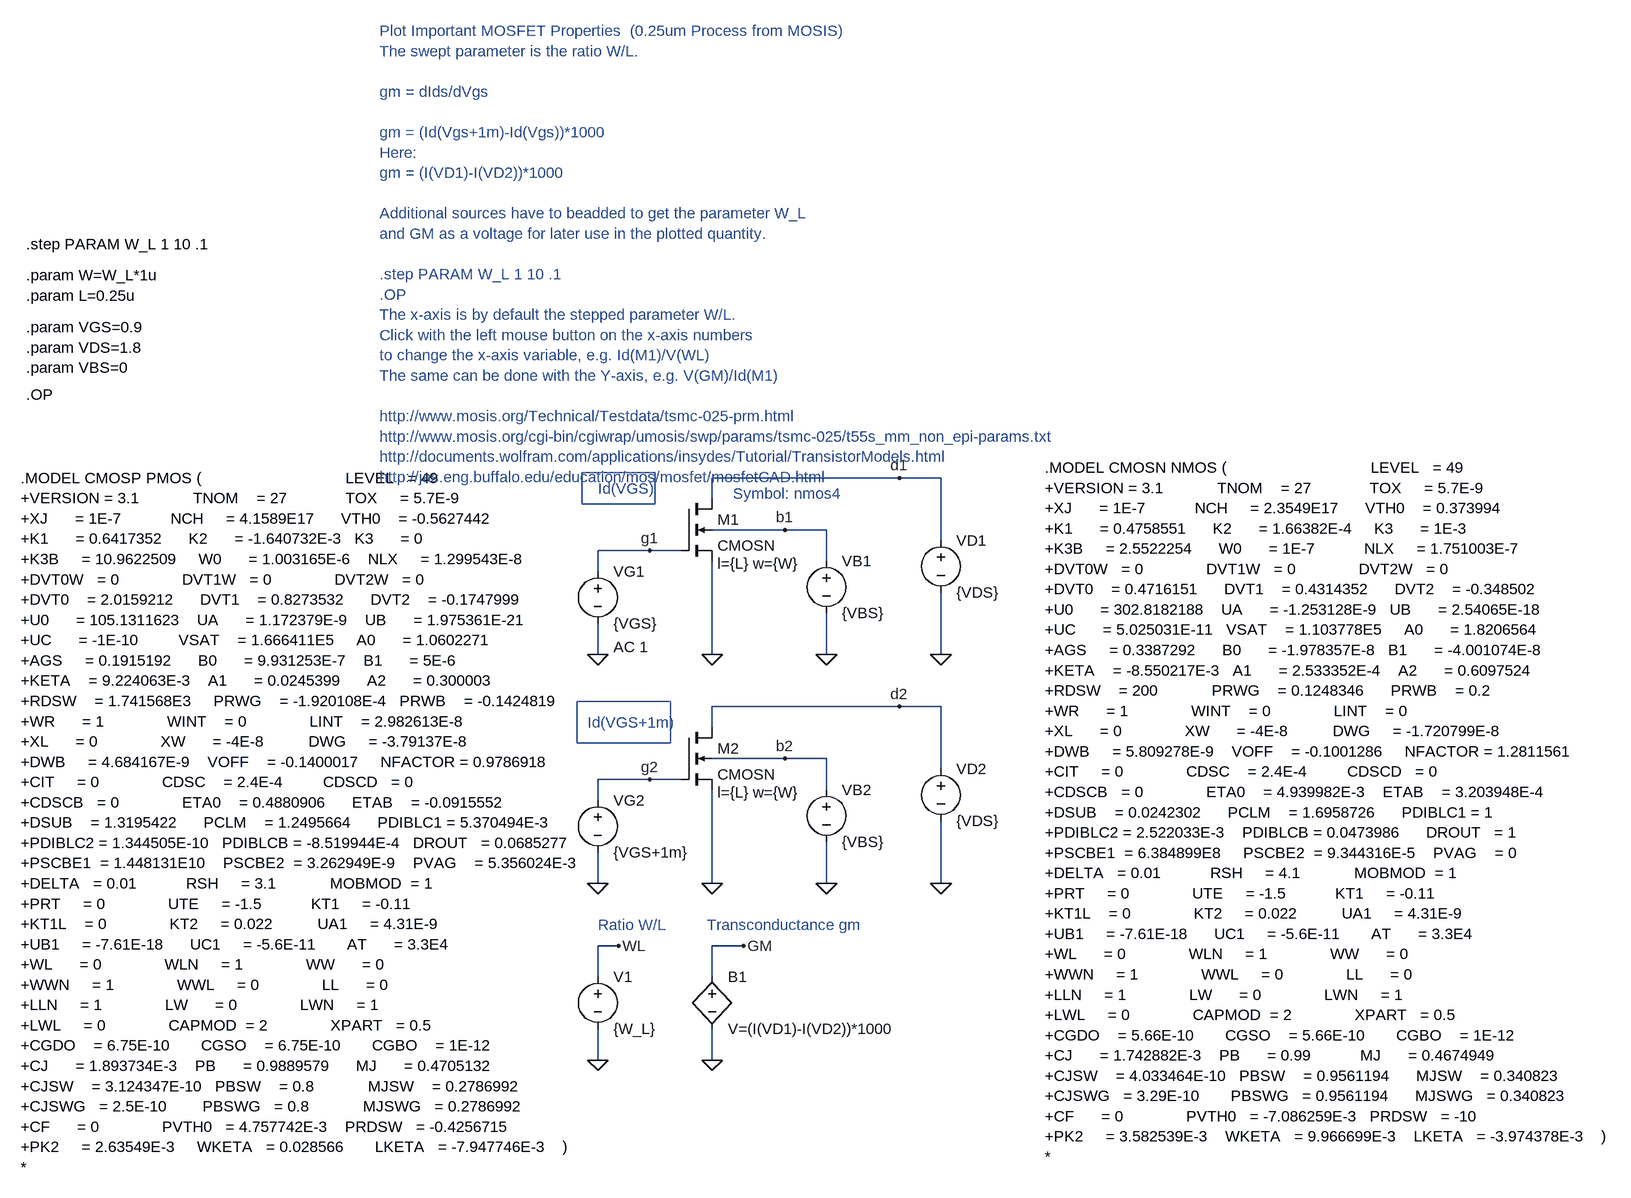
[diagram p0: schematic MOSFET_gm_and_Id_versus_W_to_L.asc]
MOSFET_gm_and_Id_versus_W_to_L.asc, the LTspice schematic file:
Version 4
SHEET 1 3220 2244
WIRE 48 192 -240 192
WIRE 112 192 48 192
WIRE -240 224 -240 192
WIRE -128 272 -240 272
WIRE -64 272 -128 272
WIRE 112 288 112 192
WIRE -336 304 -416 304
WIRE -288 304 -336 304
WIRE -64 320 -64 272
WIRE -416 336 -416 304
WIRE -416 464 -416 416
WIRE -240 464 -240 320
WIRE -64 464 -64 400
WIRE 112 464 112 368
WIRE 48 544 -240 544
WIRE 112 544 48 544
WIRE -240 576 -240 544
WIRE -128 624 -240 624
WIRE -64 624 -128 624
WIRE 112 640 112 544
WIRE -336 656 -416 656
WIRE -288 656 -336 656
WIRE -64 672 -64 624
WIRE -416 688 -416 656
WIRE -416 816 -416 768
WIRE -240 816 -240 672
WIRE -64 816 -64 752
WIRE 112 816 112 720
WIRE -384 912 -416 912
WIRE -192 912 -240 912
WIRE -416 960 -416 912
WIRE -240 960 -240 912
WIRE -416 1088 -416 1040
WIRE -240 1088 -240 1040
FLAG -416 464 0
FLAG 112 464 0
FLAG -336 304 g1
FLAG -64 464 0
FLAG -240 464 0
FLAG -416 816 0
FLAG 112 816 0
FLAG -336 656 g2
FLAG 48 544 d2
FLAG -64 816 0
FLAG -128 624 b2
FLAG -240 816 0
FLAG -128 272 b1
FLAG 48 192 d1
FLAG -416 1088 0
FLAG -384 912 WL
FLAG -240 1088 0
FLAG -192 912 GM
SYMBOL voltage 112 272 R0
SYMATTR InstName VD1
SYMATTR Value {VDS}
SYMBOL voltage -416 320 R0
WINDOW 123 24 132 Left 0
WINDOW 39 0 0 Left 0
SYMATTR Value2 AC 1
SYMATTR InstName VG1
SYMATTR Value {VGS}
SYMBOL nmos4 -288 224 R0
WINDOW 123 56 100 Left 0
SYMATTR Value2 l={L} w={W}
SYMATTR InstName M1
SYMATTR Value CMOSN
SYMBOL voltage -64 304 R0
SYMATTR InstName VB1
SYMATTR Value {VBS}
SYMBOL voltage 112 624 R0
WINDOW 123 24 132 Left 0
WINDOW 39 0 0 Left 0
SYMATTR InstName VD2
SYMATTR Value {VDS}
SYMBOL voltage -416 672 R0
WINDOW 123 24 132 Left 0
WINDOW 39 0 0 Left 0
SYMATTR InstName VG2
SYMATTR Value {VGS+1m}
SYMBOL voltage -64 656 R0
SYMATTR InstName VB2
SYMATTR Value {VBS}
SYMBOL nmos4 -288 576 R0
WINDOW 123 56 100 Left 0
SYMATTR Value2 l={L} w={W}
SYMATTR InstName M2
SYMATTR Value CMOSN
SYMBOL voltage -416 944 R0
SYMATTR InstName V1
SYMATTR Value {W_L}
SYMBOL bv -240 944 R0
SYMATTR InstName B1
SYMATTR Value V=(I(VD1)-I(VD2))*1000
TEXT -1296 64 Left 0 !.OP
TEXT 272 176 Left 0 !.MODEL CMOSN NMOS (                                LEVEL   = 49\n+VERSION = 3.1            TNOM    = 27             TOX     = 5.7E-9\n+XJ      = 1E-7           NCH     = 2.3549E17      VTH0    = 0.373994\n+K1      = 0.4758551      K2      = 1.66382E-4     K3      = 1E-3\n+K3B     = 2.5522254      W0      = 1E-7           NLX     = 1.751003E-7\n+DVT0W   = 0              DVT1W   = 0              DVT2W   = 0\n+DVT0    = 0.4716151      DVT1    = 0.4314352      DVT2    = -0.348502\n+U0      = 302.8182188    UA      = -1.253128E-9   UB      = 2.54065E-18\n+UC      = 5.025031E-11   VSAT    = 1.103778E5     A0      = 1.8206564\n+AGS     = 0.3387292      B0      = -1.978357E-8   B1      = -4.001074E-8\n+KETA    = -8.550217E-3   A1      = 2.533352E-4    A2      = 0.6097524\n+RDSW    = 200            PRWG    = 0.1248346      PRWB    = 0.2\n+WR      = 1              WINT    = 0              LINT    = 0\n+XL      = 0              XW      = -4E-8          DWG     = -1.720799E-8\n+DWB     = 5.809278E-9    VOFF    = -0.1001286     NFACTOR = 1.2811561\n+CIT     = 0              CDSC    = 2.4E-4         CDSCD   = 0\n+CDSCB   = 0              ETA0    = 4.939982E-3    ETAB    = 3.203948E-4\n+DSUB    = 0.0242302      PCLM    = 1.6958726      PDIBLC1 = 1\n+PDIBLC2 = 2.522033E-3    PDIBLCB = 0.0473986      DROUT   = 1\n+PSCBE1  = 6.384899E8     PSCBE2  = 9.344316E-5    PVAG    = 0\n+DELTA   = 0.01           RSH     = 4.1            MOBMOD  = 1\n+PRT     = 0              UTE     = -1.5           KT1     = -0.11\n+KT1L    = 0              KT2     = 0.022          UA1     = 4.31E-9\n+UB1     = -7.61E-18      UC1     = -5.6E-11       AT      = 3.3E4\n+WL      = 0              WLN     = 1              WW      = 0\n+WWN     = 1              WWL     = 0              LL      = 0\n+LLN     = 1              LW      = 0              LWN     = 1\n+LWL     = 0              CAPMOD  = 2              XPART   = 0.5\n+CGDO    = 5.66E-10       CGSO    = 5.66E-10       CGBO    = 1E-12\n+CJ      = 1.742882E-3    PB      = 0.99           MJ      = 0.4674949\n+CJSW    = 4.033464E-10   PBSW    = 0.9561194      MJSW    = 0.340823\n+CJSWG   = 3.29E-10       PBSWG   = 0.9561194      MJSWG   = 0.340823\n+CF      = 0              PVTH0   = -7.086259E-3   PRDSW   = -10\n+PK2     = 3.582539E-3    WKETA   = 9.966699E-3    LKETA   = -3.974378E-3    )\n*
TEXT -1296 -40 Left 0 !.param VGS=0.9\n.param VDS=1.8\n.param VBS=0
TEXT -1304 192 Left 0 !.MODEL CMOSP PMOS (                                LEVEL   = 49\n+VERSION = 3.1            TNOM    = 27             TOX     = 5.7E-9\n+XJ      = 1E-7           NCH     = 4.1589E17      VTH0    = -0.5627442\n+K1      = 0.6417352      K2      = -1.640732E-3   K3      = 0\n+K3B     = 10.9622509     W0      = 1.003165E-6    NLX     = 1.299543E-8\n+DVT0W   = 0              DVT1W   = 0              DVT2W   = 0\n+DVT0    = 2.0159212      DVT1    = 0.8273532      DVT2    = -0.1747999\n+U0      = 105.1311623    UA      = 1.172379E-9    UB      = 1.975361E-21\n+UC      = -1E-10         VSAT    = 1.666411E5     A0      = 1.0602271\n+AGS     = 0.1915192      B0      = 9.931253E-7    B1      = 5E-6\n+KETA    = 9.224063E-3    A1      = 0.0245399      A2      = 0.300003\n+RDSW    = 1.741568E3     PRWG    = -1.920108E-4   PRWB    = -0.1424819\n+WR      = 1              WINT    = 0              LINT    = 2.982613E-8\n+XL      = 0              XW      = -4E-8          DWG     = -3.79137E-8\n+DWB     = 4.684167E-9    VOFF    = -0.1400017     NFACTOR = 0.9786918\n+CIT     = 0              CDSC    = 2.4E-4         CDSCD   = 0\n+CDSCB   = 0              ETA0    = 0.4880906      ETAB    = -0.0915552\n+DSUB    = 1.3195422      PCLM    = 1.2495664      PDIBLC1 = 5.370494E-3\n+PDIBLC2 = 1.344505E-10   PDIBLCB = -8.519944E-4   DROUT   = 0.0685277\n+PSCBE1  = 1.448131E10    PSCBE2  = 3.262949E-9    PVAG    = 5.356024E-3\n+DELTA   = 0.01           RSH     = 3.1            MOBMOD  = 1\n+PRT     = 0              UTE     = -1.5           KT1     = -0.11\n+KT1L    = 0              KT2     = 0.022          UA1     = 4.31E-9\n+UB1     = -7.61E-18      UC1     = -5.6E-11       AT      = 3.3E4\n+WL      = 0              WLN     = 1              WW      = 0\n+WWN     = 1              WWL     = 0              LL      = 0\n+LLN     = 1              LW      = 0              LWN     = 1\n+LWL     = 0              CAPMOD  = 2              XPART   = 0.5\n+CGDO    = 6.75E-10       CGSO    = 6.75E-10       CGBO    = 1E-12\n+CJ      = 1.893734E-3    PB      = 0.9889579      MJ      = 0.4705132\n+CJSW    = 3.124347E-10   PBSW    = 0.8            MJSW    = 0.2786992\n+CJSWG   = 2.5E-10        PBSWG   = 0.8            MJSWG   = 0.2786992\n+CF      = 0              PVTH0   = 4.757742E-3    PRDSW   = -0.4256715\n+PK2     = 2.63549E-3     WKETA   = 0.028566       LKETA   = -7.947746E-3    )\n*
TEXT -416 208 Left 0 ;Id(VGS)
TEXT -432 568 Left 0 ;Id(VGS+1m)
TEXT -208 216 Left 0 ;Symbol: nmos4
TEXT -752 -496 Left 0 ;Plot Important MOSFET Properties  (0.25um Process from MOSIS)\nThe swept parameter is the ratio W/L.\n \ngm = dIds/dVgs\n \ngm = (Id(Vgs+1m)-Id(Vgs))*1000\nHere:\ngm = (I(VD1)-I(VD2))*1000\n \nAdditional sources have to beadded to get the parameter W_L \nand GM as a voltage for later use in the plotted quantity.\n \n.step PARAM W_L 1 10 .1\n.OP\nThe x-axis is by default the stepped parameter W/L.\nClick with the left mouse button on the x-axis numbers \nto change the x-axis variable, e.g. Id(M1)/V(WL)\nThe same can be done with the Y-axis, e.g. V(GM)/Id(M1)\n \nhttp://www.mosis.org/Technical/Testdata/tsmc-025-prm.html \nhttp://www.mosis.org/cgi-bin/cgiwrap/umosis/swp/params/tsmc-025/t55s_mm_non_epi-params.txt\nhttp://documents.wolfram.com/applications/insydes/Tutorial/TransistorModels.html\nhttp://jas.eng.buffalo.edu/education/mos/mosfet/mosfetCAD.html
TEXT -1296 -120 Left 0 !.param W=W_L*1u\n.param L=0.25u
TEXT -1296 -168 Left 0 !.step PARAM W_L 1 10 .1
TEXT -416 880 Left 0 ;Ratio W/L
TEXT -248 880 Left 0 ;Transconductance gm
RECTANGLE Normal -328 232 -440 184
RECTANGLE Normal -304 600 -448 536

The netlist it stands for:
* MOSFET_gm_and_Id_versus_W_to_L.asc
VD1 d1 0 {VDS}
VG1 g1 0 {VGS} AC 1
M1 d1 g1 0 b1 CMOSN l={L} w={W}
VB1 b1 0 {VBS}
VD2 d2 0 {VDS}
VG2 g2 0 {VGS+1m}
VB2 b2 0 {VBS}
M2 d2 g2 0 b2 CMOSN l={L} w={W}
V1 WL 0 {W_L}
B1 GM 0 V=(I(VD1)-I(VD2))*1000
.model NMOS NMOS
.model PMOS PMOS
.lib standard.mos
.OP
.MODEL CMOSN NMOS (                                LEVEL   = 49
+VERSION = 3.1            TNOM    = 27             TOX     = 5.7E-9
+XJ      = 1E-7           NCH     = 2.3549E17      VTH0    = 0.373994
+K1      = 0.4758551      K2      = 1.66382E-4     K3      = 1E-3
+K3B     = 2.5522254      W0      = 1E-7           NLX     = 1.751003E-7
+DVT0W   = 0              DVT1W   = 0              DVT2W   = 0
+DVT0    = 0.4716151      DVT1    = 0.4314352      DVT2    = -0.348502
+U0      = 302.8182188    UA      = -1.253128E-9   UB      = 2.54065E-18
+UC      = 5.025031E-11   VSAT    = 1.103778E5     A0      = 1.8206564
+AGS     = 0.3387292      B0      = -1.978357E-8   B1      = -4.001074E-8
+KETA    = -8.550217E-3   A1      = 2.533352E-4    A2      = 0.6097524
+RDSW    = 200            PRWG    = 0.1248346      PRWB    = 0.2
+WR      = 1              WINT    = 0              LINT    = 0
+XL      = 0              XW      = -4E-8          DWG     = -1.720799E-8
+DWB     = 5.809278E-9    VOFF    = -0.1001286     NFACTOR = 1.2811561
+CIT     = 0              CDSC    = 2.4E-4         CDSCD   = 0
+CDSCB   = 0              ETA0    = 4.939982E-3    ETAB    = 3.203948E-4
+DSUB    = 0.0242302      PCLM    = 1.6958726      PDIBLC1 = 1
+PDIBLC2 = 2.522033E-3    PDIBLCB = 0.0473986      DROUT   = 1
+PSCBE1  = 6.384899E8     PSCBE2  = 9.344316E-5    PVAG    = 0
+DELTA   = 0.01           RSH     = 4.1            MOBMOD  = 1
+PRT     = 0              UTE     = -1.5           KT1     = -0.11
+KT1L    = 0              KT2     = 0.022          UA1     = 4.31E-9
+UB1     = -7.61E-18      UC1     = -5.6E-11       AT      = 3.3E4
+WL      = 0              WLN     = 1              WW      = 0
+WWN     = 1              WWL     = 0              LL      = 0
+LLN     = 1              LW      = 0              LWN     = 1
+LWL     = 0              CAPMOD  = 2              XPART   = 0.5
+CGDO    = 5.66E-10       CGSO    = 5.66E-10       CGBO    = 1E-12
+CJ      = 1.742882E-3    PB      = 0.99           MJ      = 0.4674949
+CJSW    = 4.033464E-10   PBSW    = 0.9561194      MJSW    = 0.340823
+CJSWG   = 3.29E-10       PBSWG   = 0.9561194      MJSWG   = 0.340823
+CF      = 0              PVTH0   = -7.086259E-3   PRDSW   = -10
+PK2     = 3.582539E-3    WKETA   = 9.966699E-3    LKETA   = -3.974378E-3    )
*
.param VGS=0.9
.param VDS=1.8
.param VBS=0
.MODEL CMOSP PMOS (                                LEVEL   = 49
+VERSION = 3.1            TNOM    = 27             TOX     = 5.7E-9
+XJ      = 1E-7           NCH     = 4.1589E17      VTH0    = -0.5627442
+K1      = 0.6417352      K2      = -1.640732E-3   K3      = 0
+K3B     = 10.9622509     W0      = 1.003165E-6    NLX     = 1.299543E-8
+DVT0W   = 0              DVT1W   = 0              DVT2W   = 0
+DVT0    = 2.0159212      DVT1    = 0.8273532      DVT2    = -0.1747999
+U0      = 105.1311623    UA      = 1.172379E-9    UB      = 1.975361E-21
+UC      = -1E-10         VSAT    = 1.666411E5     A0      = 1.0602271
+AGS     = 0.1915192      B0      = 9.931253E-7    B1      = 5E-6
+KETA    = 9.224063E-3    A1      = 0.0245399      A2      = 0.300003
+RDSW    = 1.741568E3     PRWG    = -1.920108E-4   PRWB    = -0.1424819
+WR      = 1              WINT    = 0              LINT    = 2.982613E-8
+XL      = 0              XW      = -4E-8          DWG     = -3.79137E-8
+DWB     = 4.684167E-9    VOFF    = -0.1400017     NFACTOR = 0.9786918
+CIT     = 0              CDSC    = 2.4E-4         CDSCD   = 0
+CDSCB   = 0              ETA0    = 0.4880906      ETAB    = -0.0915552
+DSUB    = 1.3195422      PCLM    = 1.2495664      PDIBLC1 = 5.370494E-3
+PDIBLC2 = 1.344505E-10   PDIBLCB = -8.519944E-4   DROUT   = 0.0685277
+PSCBE1  = 1.448131E10    PSCBE2  = 3.262949E-9    PVAG    = 5.356024E-3
+DELTA   = 0.01           RSH     = 3.1            MOBMOD  = 1
+PRT     = 0              UTE     = -1.5           KT1     = -0.11
+KT1L    = 0              KT2     = 0.022          UA1     = 4.31E-9
+UB1     = -7.61E-18      UC1     = -5.6E-11       AT      = 3.3E4
+WL      = 0              WLN     = 1              WW      = 0
+WWN     = 1              WWL     = 0              LL      = 0
+LLN     = 1              LW      = 0              LWN     = 1
+LWL     = 0              CAPMOD  = 2              XPART   = 0.5
+CGDO    = 6.75E-10       CGSO    = 6.75E-10       CGBO    = 1E-12
+CJ      = 1.893734E-3    PB      = 0.9889579      MJ      = 0.4705132
+CJSW    = 3.124347E-10   PBSW    = 0.8            MJSW    = 0.2786992
+CJSWG   = 2.5E-10        PBSWG   = 0.8            MJSWG   = 0.2786992
+CF      = 0              PVTH0   = 4.757742E-3    PRDSW   = -0.4256715
+PK2     = 2.63549E-3     WKETA   = 0.028566       LKETA   = -7.947746E-3    )
*
* Id(VGS)
* Id(VGS+1m)
* Symbol: nmos4
* Plot Important MOSFET Properties  (0.25um Process from MOSIS)
* The swept parameter is the ratio W/L.
* gm = dIds/dVgs
* gm = (Id(Vgs+1m)-Id(Vgs))*1000
* Here:
* gm = (I(VD1)-I(VD2))*1000
* Additional sources have to beadded to get the parameter W_L
* and GM as a voltage for later use in the plotted quantity.
* .step PARAM W_L 1 10 .1
* .OP
* The x-axis is by default the stepped parameter W/L.
* Click with the left mouse button on the x-axis numbers
* to change the x-axis variable, e.g. Id(M1)/V(WL)
* The same can be done with the Y-axis, e.g. V(GM)/Id(M1)
* http://www.mosis.org/Technical/Testdata/tsmc-025-prm.html
* http://www.mosis.org/cgi-bin/cgiwrap/umosis/swp/params/tsmc-025/t55s_mm_non_epi-params.txt
* http://documents.wolfram.com/applications/insydes/Tutorial/TransistorModels.html
* http://jas.eng.buffalo.edu/education/mos/mosfet/mosfetCAD.html
.param W=W_L*1u
.param L=0.25u
.step PARAM W_L 1 10 .1
* Ratio W/L
* Transconductance gm
.backanno
.end